# EAGLE design polarplotter (EAGLE 5.10)
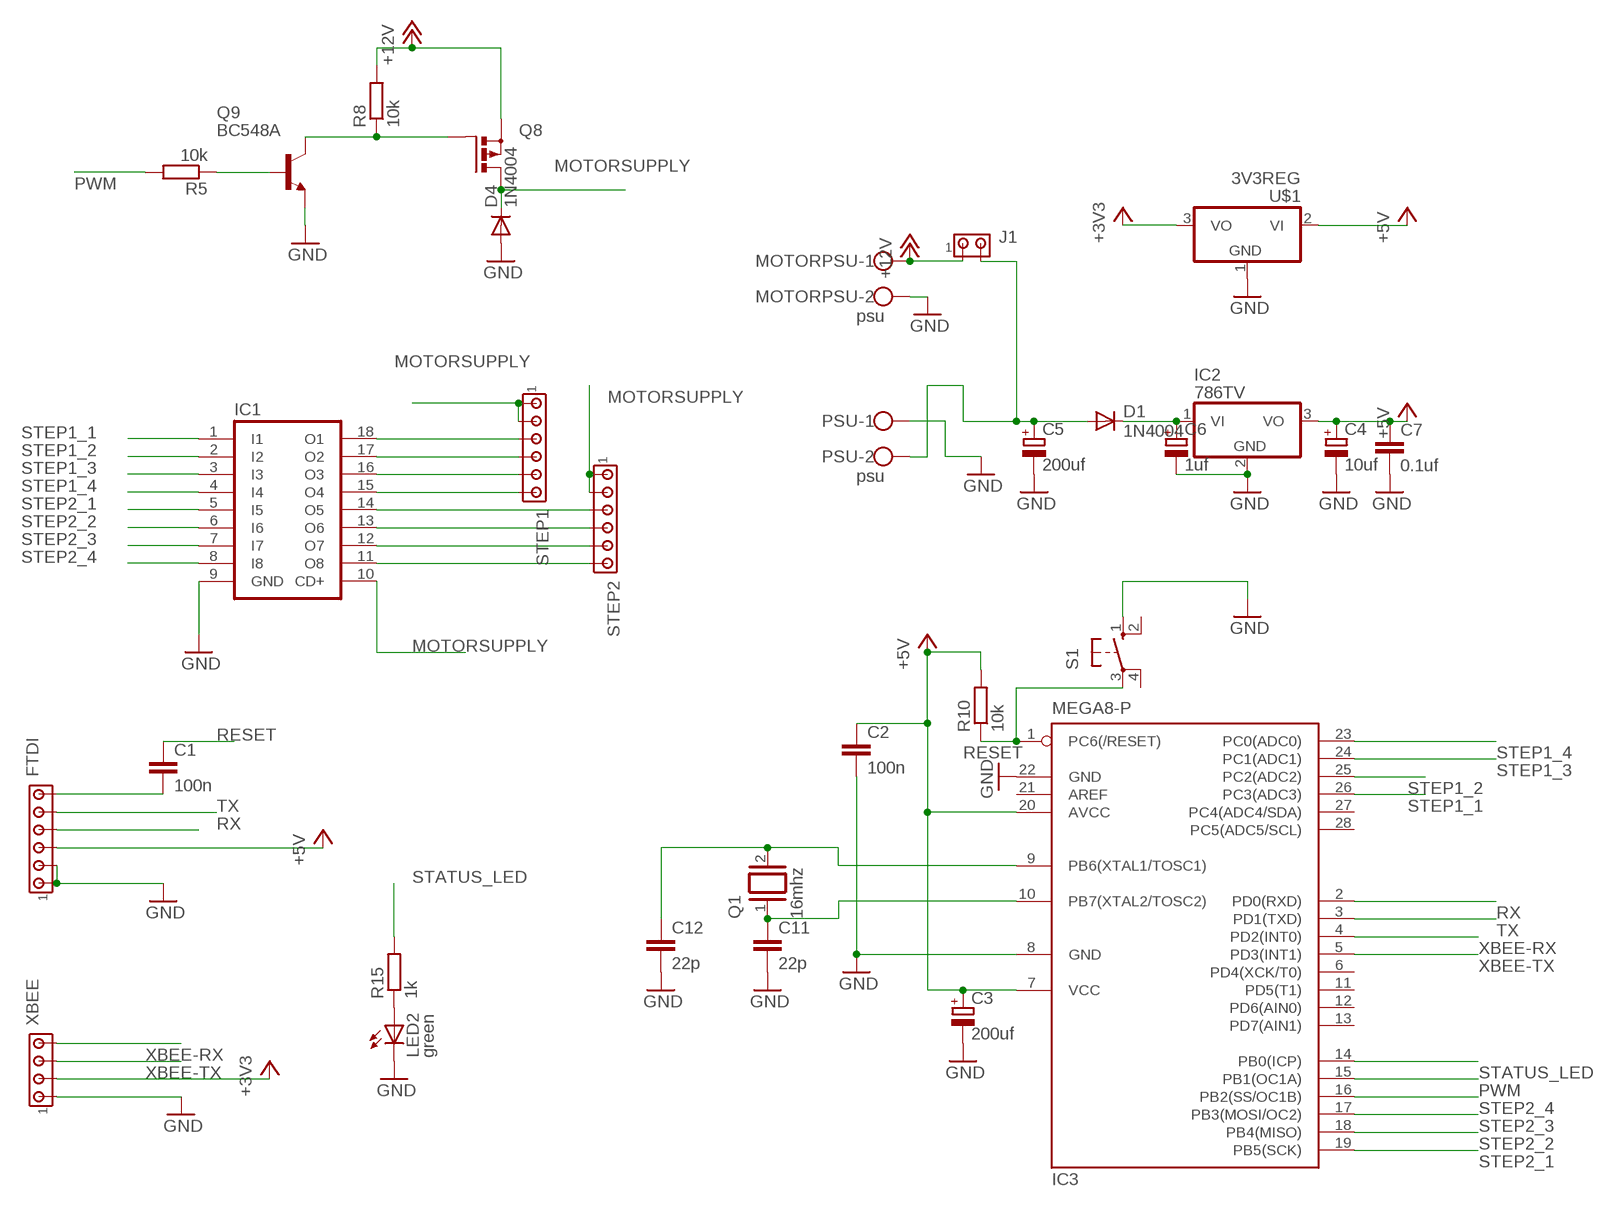
[diagram p0: schematic, sheet 1]

## Parts
C1  100n  C-EU050-025X075  [C050-025X075]
C2  100n  C-EU050-025X075  [C050-025X075]
C3  200uf  CPOL-EUE2-4  [E2-4]
C4  10uf  CPOL-EUE2-4  [E2-4]
C5  200uf  CPOL-EUE3.5-8  [E3,5-8]
C6  1uf  CPOL-EUE2-4  [E2-4]
C7  0.1uf  C-EU050-025X075  [C050-025X075]
C11  22p  C-EU050-025X075  [C050-025X075]
C12  22p  C-EU050-025X075  [C050-025X075]
D1  1N4004  [DO41-10]
D4  1N4004  [DO41-10]
FTDI  MTA06-100  [10X06MTA]
IC1  ULN2803A  [DIL18]
IC2  786TV  [TO220V]
IC3  MEGA8-P  [DIL28-3]
J1  MTA02-100  [10X02MTA]
LED2  green  LED5MM  [LED5MM]
MOTORPSU  psu  W237-102  [W237-102]
PSU  psu  W237-102  [W237-102]
Q1  16mhz  XTAL/S  [QS]
Q8  PMOSFET_PTO220BV  [TO220BV]
Q9  BC548A  [TO92-EBC]
R5  10k  R-EU_0204/7  [0204/7]
R8  10k  R-EU_0204/7  [0204/7]
R10  10k  R-EU_0204/7  [0204/7]
R15  1k  R-EU_0204/7  [0204/7]
S1  10-XX  [B3F-10XX]
STEP1  MTA06-100  [10X06MTA]
STEP2  MTA06-100  [10X06MTA]
U$1  3V3REG  [TO92]
XBEE  MTA04-100  [10X04MTA]

## Nets
+3V3: U$1.3(VO) XBEE.2
+5V: C2.1 C3.+ C4.+ C7.1 FTDI.4 IC2.3(VO) IC3.7(VCC) IC3.20(AVCC) R10.2 U$1.2(VI)
+12V [power]: J1.1 MOTORPSU.1 Q8.S R8.2
GND: C2.2 C3.- C4.- C5.- C6.- C7.2 C11.2 C12.2 D4.A FTDI.5 FTDI.6 IC1.9(GND) IC2.2(GND) IC3.8(GND) IC3.22(GND) LED2.K(C) MOTORPSU.2 PSU.1 Q9.E S1.1(S) U$1.1(GND) XBEE.1
MOTORSUPPLY [power]: D4.C IC1.10(CD+) Q8.D STEP1.5 STEP1.6 STEP2.5 STEP2.6
N$1: IC1.18(O1) STEP1.4
N$2 [power]: C5.+ D1.A J1.2 PSU.2
N$4: IC1.17(O2) STEP1.3
N$5: C1.2 FTDI.1
N$6: IC1.16(O3) STEP1.2
N$7: IC1.15(O4) STEP1.1
N$8: IC1.14(O5) STEP2.4
N$9: IC1.13(O6) STEP2.3
N$10: C11.1 IC3.10(PB7(XTAL2/TOSC2)) Q1.1
N$11: C12.1 IC3.9(PB6(XTAL1/TOSC1)) Q1.2
N$12: IC1.12(O7) STEP2.2
N$13: IC1.11(O8) STEP2.1
N$15: LED2.A R15.1
N$17: Q8.G Q9.C R8.1
N$18: Q9.B R5.1
N$19: C6.+ D1.C IC2.1(VI)
PWM: IC3.15(PB1(OC1A)) R5.2
RESET: C1.1 IC3.1(PC6(/RESET)) R10.1 S1.3(P)
RX: FTDI.3 IC3.2(PD0(RXD))
STATUS_LED: IC3.14(PB0(ICP)) R15.2
STEP1_1: IC1.1(I1) IC3.26(PC3(ADC3))
STEP1_2: IC1.2(I2) IC3.25(PC2(ADC2))
STEP1_3: IC1.3(I3) IC3.24(PC1(ADC1))
STEP1_4: IC1.4(I4) IC3.23(PC0(ADC0))
STEP2_1: IC1.5(I5) IC3.19(PB5(SCK))
STEP2_2: IC1.6(I6) IC3.18(PB4(MISO))
STEP2_3: IC1.7(I7) IC3.17(PB3(MOSI/OC2))
STEP2_4: IC1.8(I8) IC3.16(PB2(SS/OC1B))
TX: FTDI.2 IC3.3(PD1(TXD))
XBEE-RX: IC3.4(PD2(INT0)) XBEE.4
XBEE-TX: IC3.5(PD3(INT1)) XBEE.3
Unconnected: IC3.6(PD4(XCK/T0)) IC3.11(PD5(T1)) IC3.12(PD6(AIN0)) IC3.13(PD7(AIN1)) IC3.21(AREF) IC3.27(PC4(ADC4/SDA)) IC3.28(PC5(ADC5/SCL)) S1.2(S1) S1.4(P1)

## Library data of the parts
C1 C2 C7 C11 C12 = matt rcl:C-EU: CAPACITOR, European symbol
C3-C6 = matt rcl:CPOL-EU: POLARIZED CAPACITOR, European symbol
D1 D4 = matt diode:1N4004: DIODE general purpose rectifier, 1 A
FTDI STEP1 STEP2 = matt con-amp:MTA06-100: AMP connector
IC1 = uln-udn:ULN2803A: DRIVER ARRAY
IC2 = linear:78*: Positive VOLTAGE REGULATOR Source: http://cache.national.com/ds/LM/LM78L05.pdf http://www.fairchildsemi.com/ds/LM/LM7805.pdf
IC3 = matt atmel:MEGA8-P: MICROCONTROLLER 8 Kbytes FLASH, 1 kbytes SRAM, 512 bytes EEPROM, USART, 4-channel 10 bit ADC, 2-channel 8 bit ADC Pin compatible with Atmega48, ATMega88, ATMega168 Source: avr.lbr
J1 = matt con-amp:MTA02-100: AMP connector
LED2 = matt led:LED: LED OSRAM: - CHIPLED LG R971, LG N971, LY N971, LG Q971, LY Q971, LO R971, LY R971 LH N974, LH R974 LS Q976, LO Q976, LY Q976 LO Q996 - Hyper CHIPLED LW Q18S LB Q993, LB Q99A, LB R99A - SideLED LS A670, LO A670, LY A670, LG A670, LP A670 LB A673, LV A673, LT A673, LW A673 LH A674 LY A675 LS A676, LA A676, LO A676, LY A676, LW A676 LS A679, LY A679, LG A679 - Hyper Micro SIDELED® LS Y876, LA Y876, LO Y876, LY Y876 LT Y87S - SmartLED LW L88C, LW L88S LB L89C, LB L89S, LG L890 LS L89K, LO L89K, LY L89K LS L896, LA L896, LO L896, LY L896 - TOPLED LS T670, LO T670, LY T670, LG T670, LP T670 LSG T670, LSP T670, LSY T670, LOP T670, LYG T670 LG T671, LOG T671, LSG T671 LB T673, LV T673, LT T673, LW T673 LH T674 LS T676, LA T676, LO T676, LY T676, LB T676, LH T676, LSB T676, LW T676 LB T67C, LV T67C, LT T67C, LS T67K, LO T67K, LY T67K, LW E67C LS E67B, LA E67B, LO E67B, LY E67B, LB E67C, LV E67C, LT E67C LW T67C LS T679, LY T679, LG T679 LS T770, LO T770, LY T770, LG T770, LP T770 LB T773, LV T773, LT T773, LW T773 LH T774 LS E675, LA E675, LY E675, LS T675 LS T776, LA T776, LO T776, LY T776, LB T776 LHGB T686 LT T68C, LB T68C - Hyper Mini TOPLED® LB M676 - Mini TOPLED Santana® LG M470 LS M47K, LO M47K, LY M47K Source: http://www.osram.convergy.de LUXEON: - LUMILED® LXK2-PW12-R00, LXK2-PW12-S00, LXK2-PW14-U00, LXK2-PW14-V00 LXK2-PM12-R00, LXK2-PM12-S00, LXK2-PM14-U00 LXK2-PE12-Q00, LXK2-PE12-R00, LXK2-PE12-S00, LXK2-PE14-T00, LXK2-PE14-U00 LXK2-PB12-K00, LXK2-PB12-L00, LXK2-PB12-M00, LXK2-PB14-N00, LXK2-PB14-P00, LXK2-PB14-Q00 LXK2-PR12-L00, LXK2-PR12-M00, LXK2-PR14-Q00, LXK2-PR14-R00 LXK2-PD12-Q00, LXK2-PD12-R00, LXK2-PD12-S00 LXK2-PH12-R00, LXK2-PH12-S00 LXK2-PL12-P00, LXK2-PL12-Q00, LXK2-PL12-R00 Source: www.luxeon.com KINGBRIGHT: KA-3528ASYC Source: www.kingbright.com
MOTORPSU PSU = matt con-wago-500:W237-102: WAGO SCREW CLAMP
Q1 = matt special:XTAL/S: CRYSTAL
Q8 = transistor-power:PMOSFET_P: Power MOSFET P-Channel
Q9 = matt transistor-npn:BC548*: NPN Transistor
R5 R8 R10 R15 = matt rcl:R-EU_: RESISTOR, European symbol
S1 = switch-omron:10-XX: OMRON SWITCH
U$1 = matt:3V3REG
XBEE = matt con-amp:MTA04-100: AMP connector

## Net classes
1 power: width 2 mm

## Board
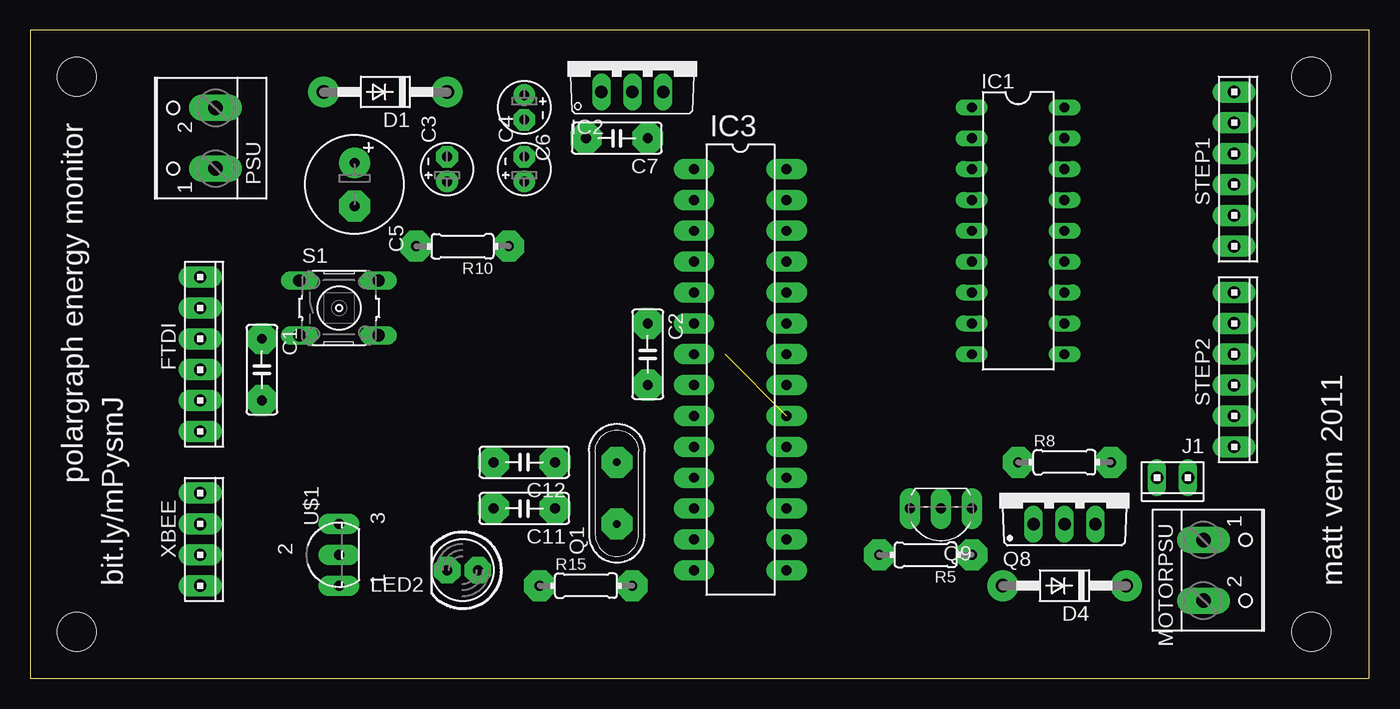
[diagram p1: board, top side]
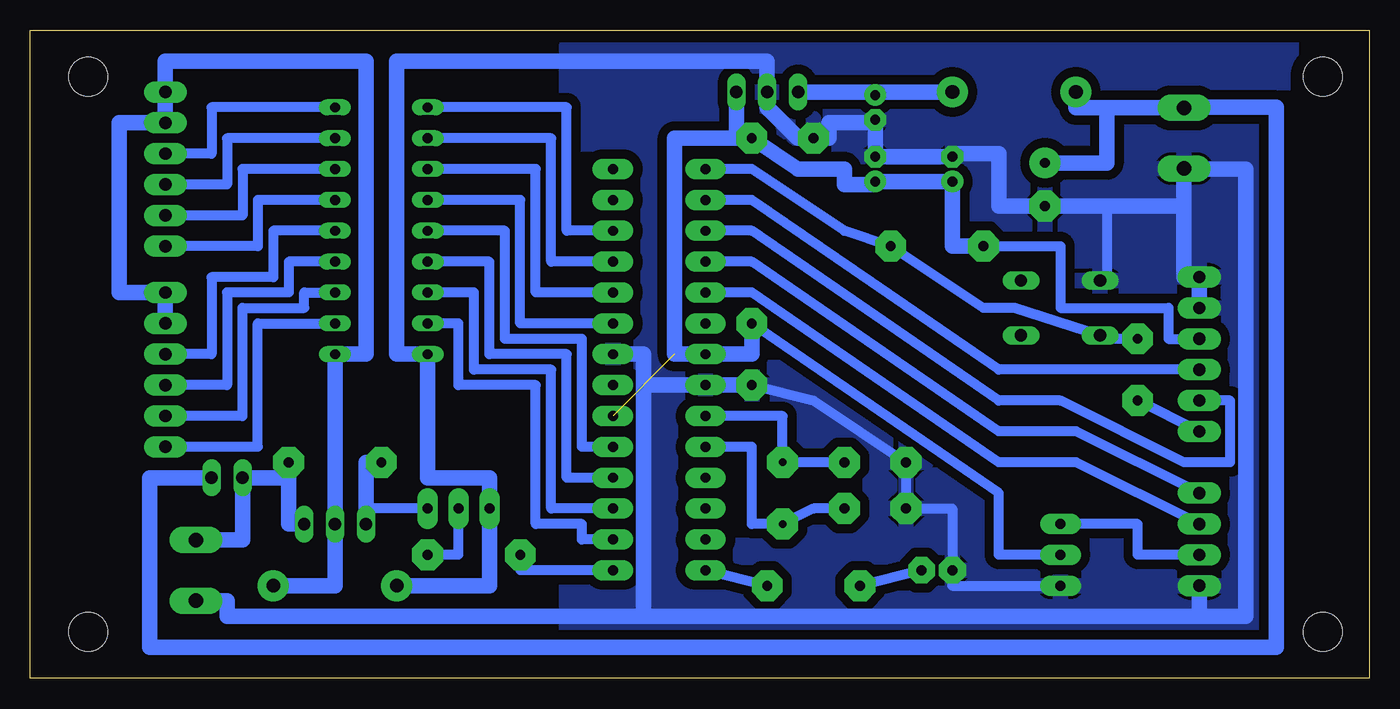
[diagram p2: board, bottom side, seen from below]

Size 110.16 x 53.33 mm. Coordinates in mm from the lower left corner, seen from the top.
Outline: 0,0 110.16,0 110.16,53.33 0,53.33 0,0
Copper layers (1*16): Top 0.035mm / dielectric 1.5mm / Bottom 0.035mm
Design rules "default": minimum track width 10mil, minimum drill 24mil, track to track 8mil, track to pad 8mil, pad to pad 8mil, via to via 8mil, smd to smd 8mil, copper to edge 40mil, drill to drill 8mil, minimum pad ring 10mil, minimum via ring 8mil, stop-mask expansion 4mil, vias tented up to drill 0mil, thermal gap 10mil
Holes 3.2 mm at 3.81,3.81 105.41,3.81 105.41,49.53 3.81,49.53

### Footprints (pad centres in the part's own frame; a part is rotated, then mirrored left to right if it is on the bottom)
C050-025X075 = drill 0.813 pad 2.54 octagon: 1 -2.54,0; 2 2.54,0
E2-4 = drill 0.813 pad 1.778 round: + -1.016,0 | drill 0.813 pad 1.778 octagon: - 1.016,0
E3,5-8 = drill 0.813 pad 2.54 round: + -1.778,0 | drill 0.813 pad 2.54 octagon: - 1.778,0
DO41-10 = drill 1.118 pad 2.54 round: A 5.08,0; C -5.08,0
10X06MTA = drill 1.016 pad 1.778 long: 1 6.35,0; 2 3.81,0; 3 1.27,0; 4 -1.27,0; 5 -3.81,0; 6 -6.35,0
DIL18 = drill 0.813 long: 1 -10.16,-3.81; 2 -7.62,-3.81; 3 -5.08,-3.81; 4 -2.54,-3.81; 5 0,-3.81; 6 2.54,-3.81; 7 5.08,-3.81; 8 7.62,-3.81; 9 10.16,-3.81; 10 10.16,3.81; 11 7.62,3.81; 12 5.08,3.81; 13 2.54,3.81; 14 0,3.81; 15 -2.54,3.81; 16 -5.08,3.81; 17 -7.62,3.81; 18 -10.16,3.81
TO220V = drill 1.016 long: 1 -2.54,-2.54; 2 0,-2.54; 3 2.54,-2.54
DIL28-3 = drill 0.813 pad 1.676 long: 1 -16.51,-3.81; 2 -13.97,-3.81; 3 -11.43,-3.81; 4 -8.89,-3.81; 5 -6.35,-3.81; 6 -3.81,-3.81; 7 -1.27,-3.81; 8 1.27,-3.81; 9 3.81,-3.81; 10 6.35,-3.81; 11 8.89,-3.81; 12 11.43,-3.81; 13 13.97,-3.81; 14 16.51,-3.81; 15 16.51,3.81; 16 13.97,3.81; 17 11.43,3.81; 18 8.89,3.81; 19 6.35,3.81; 20 3.81,3.81; 21 1.27,3.81; 22 -1.27,3.81; 23 -3.81,3.81; 24 -6.35,3.81; 25 -8.89,3.81; 26 -11.43,3.81; 27 -13.97,3.81; 28 -16.51,3.81
10X02MTA = drill 1.016 long: 1 1.27,0; 2 -1.27,0
LED5MM = drill 0.813 pad 2.184 octagon: A -1.27,0; K 1.27,0
W237-102 = drill 1.194 pad 2.184 long: 1 -2.5,-1.27; 2 2.5,-1.27
QS = drill 0.61 pad 2.54 octagon: 1 -2.54,0; 2 2.54,0
TO220BV = drill 1.016 long: D 0,-2.54; G -2.54,-2.54; S 2.54,-2.54
TO92-EBC = drill 0.813 pad 1.676 long: B 0,-1.27; C -2.54,-1.27; E 2.54,-1.27
0204/7 = drill 0.813 pad 2.54 octagon: 1 -3.81,0; 2 3.81,0
B3F-10XX = drill 1.016 long: 1 -3.251,2.261; 2 3.251,2.261; 3 -3.251,-2.261; 4 3.251,-2.261
TO92 = drill 0.813 pad 1.676 long: 1 -2.54,0; 2 0,0; 3 2.54,0
10X04MTA = drill 1.016 pad 1.778 long: 1 3.81,0; 2 1.27,0; 3 -1.27,0; 4 -3.81,0

### Placement (x,y rotation side)
C1  19.05,25.4 270 top
C2  50.8,26.67 270 top
C3  34.29,41.91 90 top
C4  40.64,41.91 90 top
C5  26.67,40.64 270 top
C6  40.64,46.99 270 top
C7  48.26,44.45 180 top
C11  40.64,13.97 180 top
C12  40.64,17.78 180 top
D1  29.21,48.26 180 top
D4  85.09,7.62 180 top
FTDI  13.97,26.67 270 top
IC1  81.28,36.83 270 top
IC2  49.53,50.8 0 top
IC3  58.42,25.4 270 top
J1  93.98,16.51 180 top
LED2  35.56,8.89 180 top
MOTORPSU  97.79,8.89 270 top
PSU  13.97,44.45 90 top
Q1  48.26,15.24 90 top
Q8  85.09,15.24 0 top
Q9  74.93,12.7 180 top
R5  73.66,10.16 180 top
R8  85.09,17.78 0 top
R10  35.56,35.56 180 top
R15  45.72,7.62 0 top
S1  25.4,30.48 0 top
STEP1  99.06,41.91 270 top
STEP2  99.06,25.4 270 top
U$1  25.4,10.16 90 top
XBEE  13.97,11.43 270 top

### Tracks (layer width: path | path; a pad name or v marks a point on that pad's centre or on a via)
+3V3
  Bottom 0.813: XBEE.2 19.05,10.16 19.05,12.7 U$1.3
+5V  (1 unrouted)
  Bottom 0.406: 40.64,40.64 C4.+
  Bottom 0.813: R10.2 25.4,35.56 25.4,30.48 16.51,30.48 16.51,27.94 FTDI.4 | U$1.2 30.48,10.16 30.48,15.24 C2.1
  Bottom 1.27: C2.1 50.8,26.67 IC3.7 57.15,26.67 57.15,44.45 C7.1 | C4.+ C3.+ 34.29,35.56 R10.2 | C7.1 46.99,41.91 43.18,41.91 43.18,40.64 40.64,40.64 | C7.1 52.07,44.45 IC2.3
+12V
  Bottom 1.27: Q8.S 88.9,12.7 88.9,16.51 | 88.9,16.51 R8.2 | 88.9,16.51 J1.1 92.71,11.39 MOTORPSU.1
GND
  Bottom 0.406: 34.29,43.18 C3.- | 15.24,41.91 PSU.1 | C6.- 40.64,45.72 | 21.59,32.74 S1.1
  Bottom 0.813: U$1.1 34.29,7.62 LED2.K 34.29,13.97 C11.2 C12.2 45.72,22.86 C2.2 | 21.59,38.86 21.59,32.74
  Bottom 1.27: FTDI.5 FTDI.6 15.24,33.02 15.24,38.86 | 15.24,38.86 21.59,38.86 C5.- 30.48,38.86 30.48,43.18 34.29,43.18 | PSU.1 15.24,38.86 | C2.2 IC3.8 59.69,24.13 | C3.- C4.- C6.- | MOTORPSU.2 93.98,6.39 93.98,5.08 59.69,5.08 | D4.A 72.39,7.62 Q9.E 72.39,16.51 77.47,16.51 IC1.9 80.01,26.67 80.01,50.8 49.53,50.8 IC2.2 49.53,46.99 46.99,44.45 C7.2 44.45,44.45 44.45,45.72 40.64,45.72 | 13.97,5.08 10.16,5.08 10.16,41.91 15.24,41.91 | 13.97,5.08 59.69,5.08 | 13.97,5.08 XBEE.1 | IC3.22 59.69,26.67 59.69,24.13 | 59.69,5.08 59.69,24.13
  pour Bottom (isolate 0.762): 1.27,52.07 66.04,52.07 66.04,1.27 1.27,1.27
MOTORSUPPLY
  Bottom 1.27: D4.C 85.09,7.62 Q8.D IC1.10 82.55,26.67 82.55,50.8 99.06,50.8 STEP1.6 STEP1.5 102.87,45.72 102.87,31.75 STEP2.6 STEP2.5
N$1
  Bottom 0.813: IC1.18 95.25,46.99 95.25,43.18 STEP1.4
N$2
  Bottom 0.406: 15.24,46.99 PSU.2
  Bottom 1.27: PSU.2 21.59,46.95 | 21.59,46.95 24.13,46.95 D1.A | C5.+ 21.59,42.42 21.59,46.95 | J1.2 100.33,16.51 100.33,2.54 7.62,2.54 7.62,46.99 15.24,46.99
N$4
  Bottom 0.813: IC1.17 93.98,44.45 93.98,40.64 STEP1.3
N$5
  Bottom 0.813: FTDI.1 C1.2
N$6
  Bottom 0.813: IC1.16 92.71,41.91 92.71,38.1 STEP1.2
N$7
  Bottom 0.813: IC1.15 91.44,39.37 91.44,35.56 STEP1.1
N$8
  Bottom 0.813: IC1.14 90.17,36.83 90.17,33.02 95.25,33.02 95.25,26.67 STEP2.4
N$9
  Bottom 0.813: STEP2.3 93.98,24.13 93.98,31.75 88.9,31.75 88.9,34.29 IC1.13
N$10
  Bottom 0.813: IC3.10 50.8,19.05 50.8,12.7 Q1.1 45.72,13.97 C11.1
N$11
  Bottom 0.813: IC3.9 48.26,21.59 Q1.2 C12.1
N$12
  Bottom 0.813: IC1.12 87.63,31.75 87.63,30.48 92.71,30.48 92.71,21.59 STEP2.2
N$13
  Bottom 0.813: STEP2.1 91.44,19.05 91.44,29.21 IC1.11
N$15
  Bottom 0.813: LED2.A R15.1
N$17
  Bottom 0.813: Q9.C 82.55,13.97
  Bottom 1.27: R8.1 82.55,17.78 82.55,13.97 Q8.G
N$18
  Bottom 0.813: R5.1 74.93,10.16 Q9.B
N$19
  Bottom 0.406: 40.64,48.26 C6.+
  Bottom 1.27: D1.C 40.64,48.26 IC2.1
PWM
  Bottom 0.813: IC3.15 69.85,8.89 R5.2
RESET
  Bottom 0.406: 22.15,27.94 S1.3
  Bottom 0.813: C1.1 22.15,27.94 | S1.3 29.21,30.48 31.75,30.48 R10.1 43.18,36.83 50.8,41.91 IC3.1
RX
  Bottom 0.813: IC3.2 50.8,39.37 30.48,25.4 FTDI.3
STATUS_LED
  Bottom 0.813: R15.2 IC3.14
STEP1_1
  Bottom 0.813: IC3.26 66.04,36.83 66.04,46.99 IC1.1
STEP1_2
  Bottom 0.406: IC1.2 74.93,44.45
  Bottom 0.813: IC3.25 67.31,34.29 67.31,44.45 IC1.2
STEP1_3
  Bottom 0.813: IC3.24 68.58,31.75 68.58,41.91 IC1.3
STEP1_4
  Bottom 0.813: IC3.23 69.85,29.21 69.85,39.37 IC1.4
STEP2_1
  Bottom 0.813: IC1.5 71.12,36.83 71.12,27.94 64.77,27.94 64.77,19.05 IC3.19
STEP2_2
  Bottom 0.813: IC1.6 72.39,34.29 72.39,26.67 66.04,26.67 66.04,16.51 IC3.18
STEP2_3
  Bottom 0.813: IC3.17 67.31,13.97 67.31,25.4 73.66,25.4 73.66,31.75 IC1.7
STEP2_4
  Bottom 0.813: IC1.8 74.93,29.21 74.93,24.13 68.58,24.13 68.58,12.7 64.77,12.7 64.77,11.43 IC3.16
TX
  Bottom 0.813: IC3.3 50.8,36.83 30.48,22.86 25.4,22.86 15.24,17.78 11.43,17.78 11.43,22.86 FTDI.2
XBEE-RX
  Bottom 0.813: IC3.4 50.8,34.29 30.48,20.32 24.13,20.32 XBEE.4
XBEE-TX
  Bottom 0.813: IC3.5 50.8,31.75 30.48,17.78 24.13,17.78 XBEE.3

### Text on the board
tPlace: polargraph energy monitor | bit.ly/mPysmJ | matt venn 2011